# Altium schematic sheet TSAL_DCDC.SchDoc
size A3; SheetNumber: 1; SheetTotal: 1
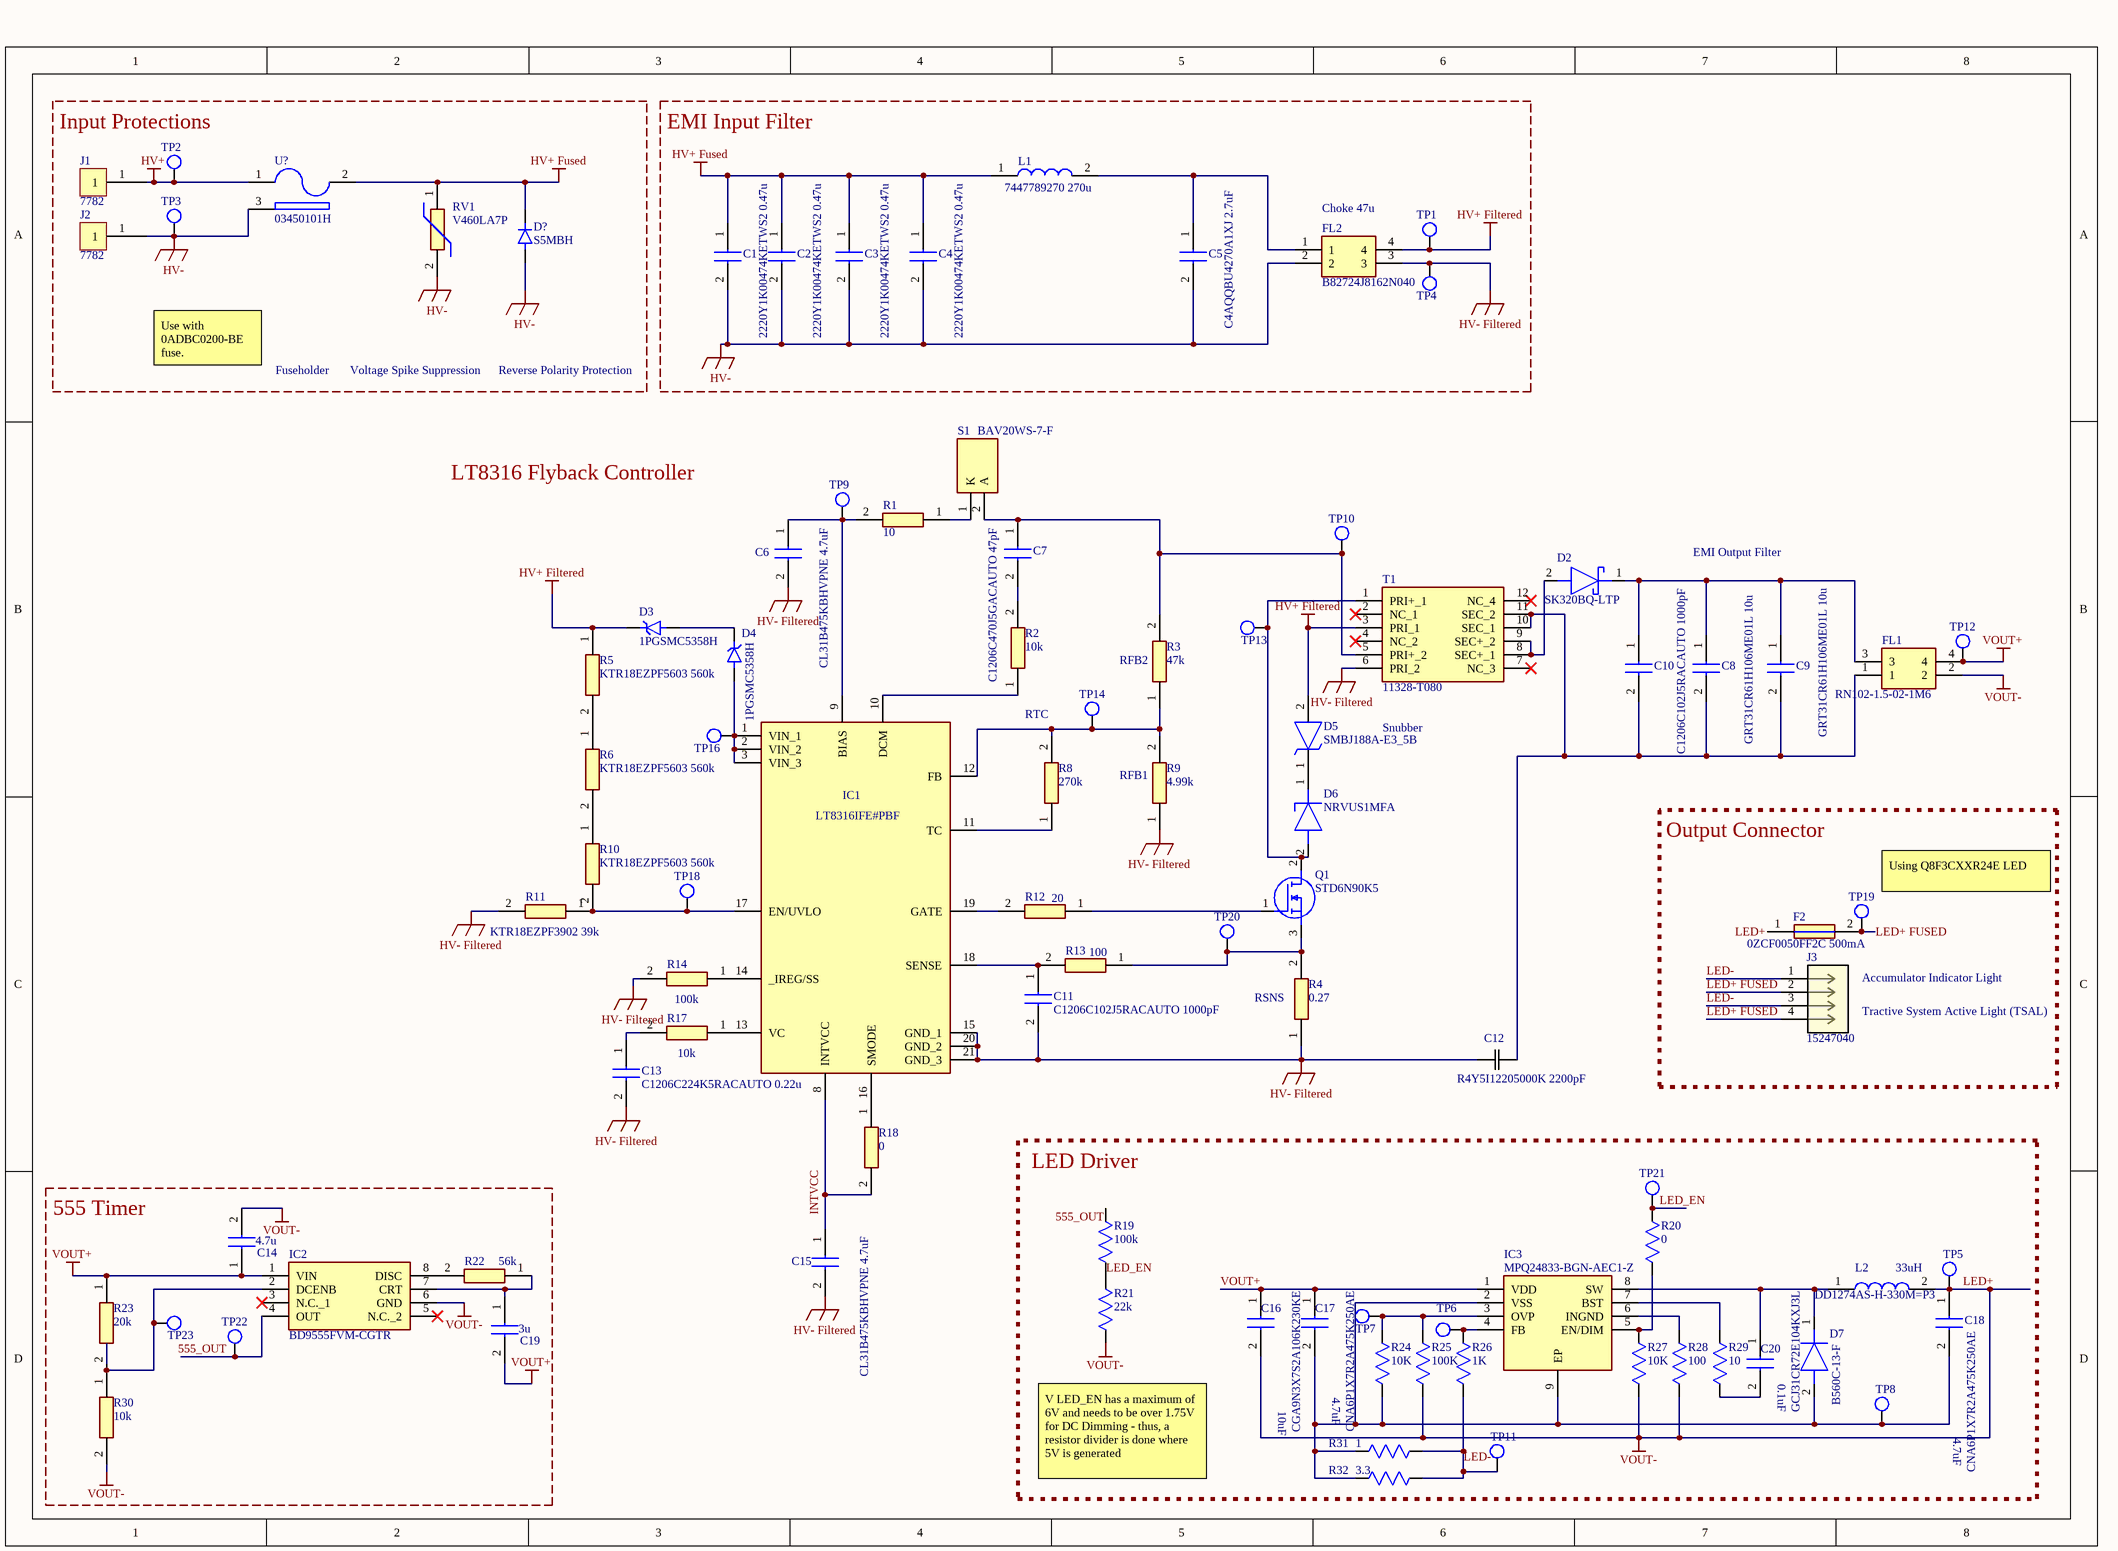
[diagram p0: TSAL_DCDC.SchDoc]

## Parts
C1  2220Y1K00474KETWS2 0.47u  [CAPC5750X200N]
C2  2220Y1K00474KETWS2 0.47u  [CAPC5750X200N]
C3  2220Y1K00474KETWS2 0.47u  [CAPC5750X200N]
C4  2220Y1K00474KETWS2 0.47u  [CAPC5750X200N]
C5  C4AQQBU4270A1XJ 2.7uF  [C4AQSBU4150A1XJ]
C6  CL31B475KBHVPNE 4.7uF  [CAPC3216X180N]
C7  C1206C470J5GACAUTO 47pF  [C1206]
C8  GRT31CR61H106ME01L 10u  [CAPC3216X180N]
C9  GRT31CR61H106ME01L 10u  [CAPC3216X180N]
C10  C1206C102J5RACAUTO 1000pF  [C1206]
C11  C1206C102J5RACAUTO 1000pF  [C1206]
C12  R4Y5I12205000K 2200pF  [CAP_R4Y5I_KEM]
C13  C1206C224K5RACAUTO 0.22u  [C1206]
C14  4.7u  [CAPC3225X279N]
C15  CL31B475KBHVPNE 4.7uF  [CAPC3216X180N]
C16  CGA9N3X7S2A106K230KE  [CAPC5850X280N]
C17  CNA6P1X7R2A475K250AE  [CAPC3225X279N]
C18  CNA6P1X7R2A475K250AE  [CAPC3225X279N]
C19  3u  [CAPC3225X279N]
C20  GCJ31CR72E104KXJ3L  [CAPC3216X200N]
D2  SK320BQ-LTP  [DIOM5336X262N]
D3  1PGSMC5358H  [DIOM6859X262N]
D4  1PGSMC5358H  [DIOM6859X262N]
D5  SMBJ188A-E3_5B  [DIOM5436X244N]
D6  NRVUS1MFA  [SODFL3618X143N]
D7  B560C-13-F  [DIOM7959X250N]
D?  S5MBH  [DIOM4336X265N]
F2  0ZCF0050FF2C 500mA  [FUSC7451X115N]
FL1  RN102-1.5-02-1M6  [RN10215021M6]
FL2  B82724J8162N040  [B82724J8162N040]
IC1  LT8316IFE#PBF  [LT8316IFEPBF]
IC2  BD9555FVM-CGTR  [SOP65P400X90-8N]
IC3  MPQ24833-BGN-AEC1-Z  [SOIC127P600X170-9N]
J1  7782  [7782-Footprint-1]
J2  7782  [7782-Footprint-1]
J3  15247040  [CONN_SDA-42385_04_MOL]
L1  7447789270 270u  [WE-PD_7332/7345_PLASTIC_BASE54]
L2  DD1274AS-H-330M=P3  [1274ASH100MP3]
Q1  STD6N90K5  [STD36P4LLF6]
R1  10  [RESC3216X65N]
R2  10k  [RESC3216X65N]
R3  47k  [RESC3216X65N]
R4  0.27  [RESC3216X65N]
R5  KTR18EZPF5603 560k  [RESC3216X65N]
R6  KTR18EZPF5603 560k  [RESC3216X65N]
R8  270k  [RESC3216X65N]
R9  4.99k  [RESC3216X65N]
R10  KTR18EZPF5603 560k  [RESC3216X65N]
R11  KTR18EZPF3902 39k  [RESC3216X65N]
R12  20  [RESC3216X65N]
R13  100  [RESC3216X65N]
R14  100k  [RESC3216X65N]
R17  10k  [RESC3216X65N]
R18  0  [RESC3216X65N]
R19  100k  [RESC3216X75N]
R20  0  [RESC3216X75N]
R21  22k  [RESC3216X75N]
R22  56k  [RESC3216X65N]
R23  20k  [RESC3216X65N]
R24  10K  [RESC3216X75N]
R25  100K  [RESC3216X75N]
R26  1K  [RESC3216X75N]
R27  10K  [RESC3216X75N]
R28  100  [RESC3216X75N]
R29  10  [RESC3216X75N]
R30  10k  [RESC3216X65N]
R31  1  [RESC3216X75N]
R32  3.3  [RESC3216X75N]
RV1  V460LA7P  [V460LA7P]
S1  BAV20WS-7-F  [SOD2513X120N]
T1  11328-T080  [11328T080]
TP1  5010  [5010]  (value not drawn)
TP2  5010  [5010]  (value not drawn)
TP3  5010  [5010]  (value not drawn)
TP4  5010  [5010]  (value not drawn)
TP5  5010  [5010]  (value not drawn)
TP6  5010  [5010]  (value not drawn)
TP7  5010  [5010]  (value not drawn)
TP8  5010  [5010]  (value not drawn)
TP9  5010  [5010]  (value not drawn)
TP10  5010  [5010]  (value not drawn)
TP11  5010  [5010]  (value not drawn)
TP12  5010  [5010]  (value not drawn)
TP13  5010  [5010]  (value not drawn)
TP14  5010  [5010]  (value not drawn)
TP16  5010  [5010]  (value not drawn)
TP18  5010  [5010]  (value not drawn)
TP19  5010  [5010]  (value not drawn)
TP20  5010  [5010]  (value not drawn)
TP21  5010  [5010]  (value not drawn)
TP22  5010  [5010]  (value not drawn)
TP23  5010  [5010]  (value not drawn)
U?  03450101H  [03450101H]

## Blocks framed on the sheet
Input Protections: D? J1 J2 RV1 TP2 TP3 U?
EMI Input Filter: C1-C5 FL2 L1 TP1 TP4
Output Connector: F2 J3 TP19
LED Driver: C16-C18 C20 D7 IC3 L2 R19-R21 R24-R29 R31 R32 TP5-TP8 TP11 TP21
555 Timer: C14 C19 IC2 R22 R23 R30 TP22 TP23

## Nets
HV+: J1.1 TP2.1 U?.1
HV+ Filtered: D3.C(K) D5.2(A) FL2.4 R5.1 T1.3(PRI_1) TP1.1
HV+ Fused: C1.1 C2.1 C3.1 C4.1 D?.C(K) L1.1 RV1.1 U?.2
HV-: C1.2 C2.2 C3.2 C4.2 C5.2 D?.A FL2.2 J2.1 RV1.2 TP3.1 U?.3
HV- Filtered: C6.2 C11.2 C12.1 C13.2 C15.2 FL2.3 IC1.15(GND_1) IC1.20(GND_2) IC1.21(GND_3) R4.1 R9.1 R11.2 R14.2 T1.6(PRI_2) TP4.1
LED+: C14.2 C16.2 C18.1 F2.1 FL1.2 IC2.6(GND) L2.2 R21.1 R25.2 R27.2 R28.2 R30.2 TP5.1  [also labelled VOUT-]
VOUT+: C14.1 C16.1 C17.1 C19.2 FL1.4 IC2.1(VIN) IC3.1(VDD) R23.1 TP12.1
555_OUT: IC2.4(OUT) R19.2 TP22.1
LED+ FUSED: F2.2 J3.2 J3.4 TP19.1
LED-: J3.1 J3.3 R26.2 R31.2 R32.2 TP11.1
LED_EN: R19.1 R20.2 R21.2 TP21.1
NetC5_1: C5.1 FL2.1 L1.2
NetC6_1: C6.1 IC1.9(BIAS) R1.2 TP9.1
NetC7_1: C7.1 R3.2 S1.2(A) T1.5(PRI+_2) TP10.1
NetC7_2: C7.2 R2.2
NetC8_1: C8.1 C9.1 C10.1 D2.1(K) FL1.3
NetC8_2: C8.2 C9.2 C10.2 C12.2 FL1.1 T1.10(SEC_1) T1.11(SEC_2)
NetC11_1: C11.1 IC1.18(SENSE) R13.2
NetC13_1: C13.1 R17.2
NetC15_1: C15.1 IC1.8(INTVCC) R18.2
NetC17_2: C17.2 C18.2 D7.2(A) IC3.2(VSS) IC3.9(EP) R24.2 R31.1 R32.1 TP8.1
NetC19_1: C19.1 IC2.7(CRT) R22.1
NetC20_1: C20.1 D7.1(K) IC3.8(SW) L2.1
NetC20_2: C20.2 R29.1
NetD2_2: D2.2(A) T1.8(SEC+_1) T1.9(SEC+_2)
NetD3_A: D3.A D4.C(K)
NetD4_A: D4.A IC1.1(VIN_1) IC1.2(VIN_2) IC1.3(VIN_3) TP16.1
NetD5_1: D5.1(K) D6.1(K)
NetD6_2: D6.2(A) Q1.2(D) T1.1(PRI+_1) TP13.1
NetIC1_10: IC1.10(DCM) R2.1
NetIC1_11: IC1.11(TC) R8.1
NetIC1_12: IC1.12(FB) R3.1 R8.2 R9.2 TP14.1
NetIC1_13: IC1.13(VC) R17.1
NetIC1_14: IC1.14(_IREG/SS) R14.1
NetIC1_16: IC1.16(SMODE) R18.1
NetIC1_17: IC1.17(EN/UVLO) R10.2 R11.1 TP18.1
NetIC1_19: IC1.19(GATE) R12.2
NetIC2_2: IC2.2(DCENB) R23.2 R30.1 TP23.1
NetIC2_8: IC2.8(DISC) R22.2
NetIC3_3: IC3.3(OVP) R24.1 R25.1 TP7.1
NetIC3_4: IC3.4(FB) R26.1 TP6.1
NetIC3_5: IC3.5(EN/DIM) R20.1 R27.1
NetIC3_6: IC3.6(INGND) R28.1
NetIC3_7: IC3.7(BST) R29.2
NetQ1_1: Q1.1(G) R12.1
NetQ1_3: Q1.3(S) R4.2 R13.1 TP20.1
NetR1_1: R1.1 S1.1(K)
NetR5_2: R5.2 R6.1
NetR6_2: R6.2 R10.1

Not connected (* = marked no-connect by the designer): IC2 3(N.C._1)* 5(N.C._2)*; T1 2(NC_1)* 4(NC_2)* 7(NC_3)* 12(NC_4)*

## Notes on the sheet
- (near FL2) Choke 47u
- Use with 0ADBC0200-BE fuse.
- Fuseholder
- Voltage Spike Suppression
- Reverse Polarity Protection
- LT8316 Flyback Controller
- EMI Output Filter
- (near R3) RFB2
- RTC
- Snubber
- (near R9) RFB1
- (near TP19) Using Q8F3CXXR24E LED
- (near R4) RSNS
- Accumulator Indicator Light
- Tractive System Active Light (TSAL)
- (near L2) 33uH
- 10uF
- 4.7uF
- 0.1uF
- V LED_EN has a maximum of 6V and needs to be over 1.75V for DC Dimming - thus, a resistor divider is done where 5V is generated
- Labels drawn without touching a wire or pin: INTVCC

## Library data of the parts
C1-C4 = 2220Y1K00474KETWS2: Capacitor; Manufacturer_Name: Knowles; Datasheet Link: https://componentsearchengine.com/Datasheets/1/2220Y1K00474KETWS2.pdf; Height: 2mm; Manufacturer_Part_Number: 2220Y1K00474KETWS2
C5 = C4AQSBU4150A1XJ: Capacitor C4AQQBU4270A1XJ actually; Manufacturer_Name: KEMET; Datasheet Link: https://content.kemet.com/datasheets/KEM_F3114_C4AQ.pdf; Height: 25.2mm; Manufacturer_Part_Number: C4AQQBU4270A1XJ
C6 C15 = CL31B475KBHVPNE: Capacitor; Manufacturer_Name: SAMSUNG; Datasheet Link: https://static6.arrow.com/aropdfconversion/b7e74fd130fed86f0f6f64070a746c2dc32c0626/cl31b475kbhvpn_specsheet.pdf; Height: 1.8mm; Manufacturer_Part_Number: CL31B475KBHVPNE; Mouser Part Number: N/A; Mouser Price/Stock: https://www.mouser.co.uk/ProductDetail/Samsung-Electro-Mechanics/CL31B475KBHVPNE?qs=WO7YBshssFEldhRLajlFiw%3D%3D
C7 = C1206C470J5GACAUTO: Capacitor; Manufacturer_Name: KEMET; Datasheet Link: https://content.kemet.com/datasheets/KEM_C1022_C0G_AUTO_SMD.pdf; Manufacturer_Part_Number: C1206C470J5GACAUTO; Mouser Part Number: 80-C1206C470J5GAUTO; Mouser Price/Stock: https://www.mouser.co.uk/ProductDetail/KEMET/C1206C470J5GACAUTO?qs=2FIyTMJ0hNmtBF6JAw%252BWLg%3D%3D
C8 C9 = GRT31CR61H106ME01L: Capacitor; Manufacturer_Name: Murata Electronics; Datasheet Link: https://search.murata.co.jp/Ceramy/image/img/A01X/G101/ENG/GRT31CR61H106ME01-01.pdf; Height: 1.8mm; Manufacturer_Part_Number: GRT31CR61H106ME01L; Mouser Part Number: 81-GRT31CR61H106ME1L; Mouser Price/Stock: https://www.mouser.co.uk/ProductDetail/Murata-Electronics/GRT31CR61H106ME01L?qs=drgMNd%252BkGPP7mqBBLgvqfw%3D%3D; Arrow Part Number: GRT31CR61H106ME01L; Arrow Price/Stock: https://www.arrow.com/en/products/grt31cr61h106me01l/murata-manufacturing?region=nac
C10 C11 = C1206C102J5RACAUTO: Capacitor; Manufacturer_Name: KEMET; Datasheet Link: https://content.kemet.com/datasheets/KEM_C1023_X7R_AUTO_SMD.pdf; Manufacturer_Part_Number: C1206C102J5RACAUTO
C12 = CMP-001-00408-1: No Description Available; Mfr_Name: Kemet; Type: Film Capacitors; Design Item ID: R4Y5I12205000K; Source: R4Y5I12205000K.SchLib
C13 = C1206C224K5RACAUTO: Capacitor; Manufacturer_Name: KEMET; Datasheet Link: https://content.kemet.com/datasheets/KEM_C1023_X7R_AUTO_SMD.pdf; Manufacturer_Part_Number: C1206C224K5RACAUTO; Mouser Part Number: 80-C1206C224K5RAUTO; Mouser Price/Stock: https://www.mouser.com/Search/Refine.aspx?Keyword=80-C1206C224K5RAUTO; Arrow Part Number: C1206C224K5RACAUTO; Arrow Price/Stock: https://www.arrow.com/en/products/c1206c224k5racauto/kemet-corporation?region=nac
C14 C17-C19 = CMP-004-000011-1: Multilayer Ceramic Capacitors MLCC - SMD/SMT 100V 4.7uF X7R 1210 10% Flex AEC-Q200; Manufacturer_Name: Kyocera AVX; Manufacturer_Part_Number: 12101C475K4Z2A; Source: SamacSys.SchLib; Arrow Part Number: 12101C475K4Z2A; Mouser Price/Stock: https://www.mouser.co.uk/ProductDetail/Kyocera-AVX/12101C475K4Z2A?qs=EU6FO9ffTwdiHnQTh%2FMZ2w%3D%3D; Height: 2.79mm; Design Item ID: 12101C475K4Z2A; Arrow Price/Stock: https://www.arrow.com/en/products/12101c475k4z2a/avx; Datasheet Link: https://www.mouser.de/ProductDetail/Kyocera-AVX/12101C475K4Z2A?qs=EU6FO9ffTwdiHnQTh%2FMZ2w%3D%3D; Mouser Part Number: 581-12101C475K4Z2A
C16 = CMP-004-000021-1: Multilayer Ceramic Capacitors MLCC - SMD/SMT SOFT 2220 100V 10uF X7S 10% AEC-Q200; Manufacturer_Name: TDK; Datasheet Link: https://product.tdk.com/system/files/dam/doc/product/capacitor/ceramic/mlcc/catalog/mlcc_automotive_soft_en.pdf; Height: 2.8mm; Manufacturer_Part_Number: CGA9N3X7S2A106K230KE; Mouser Part Number: 810-CGA9N3X7S2A106KS; Mouser Price/Stock: https://www.mouser.co.uk/ProductDetail/TDK/CGA9N3X7S2A106K230KE?qs=FxQuwy19cyC8TXs2ZwvXNA%3D%3D; Design Item ID: CGA9N3X7S2A106K230KE; Source: SamacSys.SchLib
C20 = CMP-004-000019-1: Multilayer Ceramic Capacitors MLCC - SMD/SMT 1206 0.1uF 250volts X7R 10% Soft Term; Manufacturer_Name: Murata Electronics; Datasheet Link: https://psearch.en.murata.com/capacitor/product/GCJ31CR72E104KXJ3%23.html; Height: 2mm; Manufacturer_Part_Number: GCJ31CR72E104KXJ3L; Mouser Part Number: 81-GCJ31CR72E104KX3L; Mouser Price/Stock: https://www.mouser.co.uk/ProductDetail/Murata-Electronics/GCJ31CR72E104KXJ3L?qs=z91OOxY4Wyd%252BRnESA%252BCgAQ%3D%3D; Arrow Part Number: GCJ31CR72E104KXJ3L; Arrow Price/Stock: https://www.arrow.com/en/products/gcj31cr72e104kxj3l/murata-manufacturing?region=nac; Design Item ID: GCJ31CR72E104KXJ3L; Source: SamacSys.SchLib
D2 = SK320BQ-LTP: Schottky Diode; Manufacturer_Name: MCC; Datasheet Link: https://mccsemi.com/pdf/Products/SK310BQ-L_SK320BQ-L(SMB).pdf; Height: 2.62mm; Manufacturer_Part_Number: SK320BQ-LTP
D3 D4 = CMP-004-00092-1: Availability: Unavailable; MP: 1PGSMC5358H; Price: None; Component Type: Standard; Pins: 2; Design Item ID: 1PGSMC5358H; Case/Package: None; Value: *; Source: 1PGSMC5358H.SchLib
D5 = SMBJ188A-E3_5B: TVS Diode (Uni-directional); Manufacturer_Name: Vishay; Manufacturer_Part_Number: SMBJ188A-E3/5B; Datasheet Link: http://www.vishay.com/docs/88392/smbj.pdf; Height: 2.44mm
D6 = NRVUS1MFA: Diode ESD (Uni-directional); Manufacturer_Name: onsemi; Datasheet Link: https://www.mouser.ca/datasheet/2/308/1/US1MFA_D-2320257.pdf; Height: 1.43mm; Manufacturer_Part_Number: NRVUS1MFA
D7 = CMP-017-000000-1: Schottky Diodes & Rectifiers 60V 5A; Manufacturer_Name: Diodes Incorporated; Datasheet Link: https://datasheet.lcsc.com/szlcsc/Diodes-Incorporated-B560C-13-F_C85100.pdf; Height: 2.5mm; Manufacturer_Part_Number: B560C-13-F; Mouser Part Number: 621-B560C-F; Mouser Price/Stock: https://www.mouser.co.uk/ProductDetail/Diodes-Incorporated/B560C-13-F?qs=OC0R%252Bhozcm%252BAsjMXklZLIw%3D%3D; Arrow Part Number: B560C-13-F; Arrow Price/Stock: https://www.arrow.com/en/products/b560c-13-f/diodes-incorporated?region=nac; Design Item ID: B560C-13-F; Source: SamacSys.SchLib
D? = CMP-004-00093-2: DIODE GEN PURP 5A DO214AA; Value: *; Component Type: Standard; MP: S5MBH; Availability: Unavailable; Design Item ID: S5MBH; Pins: 2; Source: S5MBH.SchLib; Case/Package: None; Price: None
F2 = 0ZCF0050FF2C: Fuse; Manufacturer_Name: BelFuse; Datasheet Link: https://componentsearchengine.com/Datasheets/2/0ZCF0050FF2C.pdf; Height: 1.15mm; Manufacturer_Part_Number: 0ZCF0050FF2C; Mouser Part Number: 530-0ZCF0050FF2C; Mouser Price/Stock: https://www.mouser.co.uk/ProductDetail/Bel-Fuse/0ZCF0050FF2C?qs=SRYZG9HaIQ2nQLM5Xvfc5w%3D%3D; Arrow Part Number: 0ZCF0050FF2C; Arrow Price/Stock: https://www.arrow.com/en/products/0zcf0050ff2c/bel-group?region=europe
FL1 = RN102-1.5-02-1M6: Filter; Manufacturer_Name: Schaffner; Datasheet Link: https://www.arrow.com/en/products/rn102-1.5-02-1m6/schaffner; Height: 9.3mm; Manufacturer_Part_Number: RN102-1.5-02-1M6; Mouser Part Number: 631-RN102-1.5-02-1M6; Mouser Price/Stock: https://www.mouser.co.uk/ProductDetail/Schaffner/RN102-1.5-02-1M6?qs=WyAARYrbSnZUk2zsVcIpdw%3D%3D; Arrow Part Number: RN102-1.5-02-1M6; Arrow Price/Stock: https://www.arrow.com/en/products/rn102-1.5-02-1m6/schaffner?region=nac
FL2 = B82724J8162N040: Filter; Manufacturer_Name: TDK; Datasheet Link: https://product.tdk.com/system/files/dam/doc/product/emc/emc/line-filter/data_sheet/30/ds/b82724j8xn.pdf; Height: 33.2mm; Manufacturer_Part_Number: B82724J8162N040; Mouser Part Number: 871-B82724J8162N040; Mouser Price/Stock: https://www.mouser.co.uk/ProductDetail/EPCOS-TDK/B82724J8162N040?qs=%252BEew9%252B0nqrCJ%252BtEJRIYp4Q%3D%3D; Arrow Part Number: B82724J8162N040; Arrow Price/Stock: https://www.arrow.com/en/products/b82724j8162n040/epcos-tdk
IC1 = LT8316IFE#PBF: Integrated Circuit; Manufacturer_Name: Analog Devices; Datasheet Link: https://www.mouser.de/datasheet/2/609/LT8316-1545981.pdf; Height: 1.2mm; Manufacturer_Part_Number: LT8316IFE#PBF; Mouser Part Number: 584-LT8316IFE#PBF; Mouser Price/Stock: https://www.mouser.co.uk/ProductDetail/Analog-Devices/LT8316IFEPBF?qs=0lSvoLzn4L8i5eDlmF3zZw%3D%3D; Arrow Part Number: LT8316IFE#PBF; Arrow Price/Stock: https://www.arrow.com/en/products/lt8316ifepbf/analog-devices?region=nac
IC2 = BD9555FVM-CGTR: Integrated Circuit; Manufacturer_Name: ROHM Semiconductor; Datasheet Link: https://componentsearchengine.com/Datasheets/1/BD9555FVM-CGTR.pdf; Height: 0.9mm; Manufacturer_Part_Number: BD9555FVM-CGTR; Mouser Part Number: 755-BD9555FVM-CGTR; Mouser Price/Stock: https://www.mouser.co.uk/ProductDetail/ROHM-Semiconductor/BD9555FVM-CGTR?qs=zGux8KhMp6L6leLJfwr4Uw%3D%3D
IC3 = CMP-006-000033-1: MONOLITHIC POWER SYSTEMS (MPS) - MPQ24833-BGN-AEC1-Z - LED Driver; Mouser Price/Stock: https://www.mouser.co.uk/ProductDetail/Monolithic-Power-Systems-MPS/MPQ24833-BGN-AEC1-Z?qs=GedFDFLaBXG49qp8%2FyrO0w%3D%3D; Manufacturer_Name: Monolithic Power Systems (MPS); Height: 1.7mm; Source: SamacSys.SchLib; Design Item ID: MPQ24833-BGN-AEC1-Z; Mouser Part Number: 946-MPQ24833BGNAEC1Z; Datasheet Link: https://www.mouser.in/datasheet/2/277/MPQ24833_BGN_AEC1-2946532.pdf; Manufacturer_Part_Number: MPQ24833-BGN-AEC1-Z
J1 J2 = CMP-002-00097-2: Screw terminal
J3 = CMP-056-000000-2: 0015247040 molex 4 pin connector; Mfr_Name: Molex Connector Corporation; Source: 15247040.SchLib; Design Item ID: 15247040; Type: Type; RefDes: RefDes
L1 = 7447789270: Inductor; Manufacturer_Name: Wurth Elektronik; Manufacturer_Part_Number: 7447789270; Mouser Part Number: 710-7447789270; Mouser Price/Stock: https://www.mouser.co.uk/ProductDetail/Wurth-Elektronik/7447789270?qs=XJfXErqHgA5azZScX3JK7w%3D%3D
L2 = CMP-005-000014-1: DEM10050C_DD Series Inductor 33uH +/-20% 3939 (100100); Manufacturer_Name: Murata Electronics; Manufacturer_Part_Number: DD1274AS-H-330M=P3; Arrow Part Number: DD1274AS-H-330M=P3; Design Item ID: DD1274AS-H-330M=P3; Mouser Price/Stock: https://www.mouser.co.uk/ProductDetail/Murata-Electronics/DD1274AS-H-330M%3dP3?qs=ty6qhqyUUEupALyz55KYRQ%3D%3D; Height: 5.3mm; Datasheet Link: https://psearch.en.murata.com/inductor/product/DD1274AS-H-330M%23.html; Source: SamacSys.SchLib; Mouser Part Number: 81-DD1274AS-H-330MP3; Arrow Price/Stock: https://www.arrow.com/en/products/dd1274as-h-330mp3/murata-manufacturing
Q1 = STD6N90K5: MOSFET (N-Channel); Manufacturer_Name: STMicroelectronics; Datasheet Link: https://www.st.com/resource/en/datasheet/std6n90k5.pdf; Height: 2mm; Manufacturer_Part_Number: STD6N90K5; Arrow Part Number: STD6N90K5; Arrow Price/Stock: https://www.arrow.com/en/products/std6n90k5/stmicroelectronics?utm_currency=USD&region=nac
R1 R2 R5 R6 R10 R22 R23 R30 = KTR18EZPF5603: Resistor; Manufacturer_Name: ROHM Semiconductor; Datasheet Link: http://rohmfs.rohm.com/en/products/databook/datasheet/passive/resistor/chip_resistor/ktr.pdf; Height: 0.65mm; Manufacturer_Part_Number: KTR18EZPF5603; Mouser Part Number: 755-KTR18EZPF5603; Mouser Price/Stock: https://www.mouser.com/Search/Refine.aspx?Keyword=755-KTR18EZPF5603
R3 R4 R8 R9 R11-R14 R17 R18 = KTR18EZPF3902: Resistor; Manufacturer_Name: ROHM Semiconductor; Datasheet Link: http://rohmfs.rohm.com/en/products/databook/datasheet/passive/resistor/chip_resistor/ktr.pdf; Height: 0.65mm; Manufacturer_Part_Number: KTR18EZPF3902
R19-R21 R24-R29 R31 R32 = CMP-009-00233-1: Resistor; Manufacturer_Name: Bourns; Manufacturer_Part_Number: CR1206-F/-2R00ELF; Height: 0.75mm; Mouser Part Number: 652-CR1206-F/2R00ELF; Mouser Price/Stock: https://www.mouser.co.uk/ProductDetail/Bourns/CR1206-F-2R00ELF?qs=W%2FMpXkg%252BdQ47Z%2FeZv1nDSg%3D%3D; Design Item ID: CR1206-F_-2R00ELF; Source: SamacSys.SchLib
RV1 = V460LA7P: Varistor; Manufacturer_Name: LITTELFUSE; Datasheet Link: https://m.littelfuse.com/media?resourcetype=datasheets&itemid=f7c547ce-c2fa-4789-86cc-ec39a5060afb&filename=littelfuse-varistor-la-datasheet; Height: 13mm; Manufacturer_Part_Number: V460LA7P
S1 = BAV20WS-7-F: Switch; Manufacturer_Name: Diodes Incorporated; Datasheet Link: https://www.diodes.com//assets/Datasheets/BAV19WS-BAV21WS.pdf; Height: 1.2mm; Manufacturer_Part_Number: BAV20WS-7-F; Arrow Part Number: BAV20WS-7-F; Arrow Price/Stock: https://www.arrow.com/en/products/bav20ws-7-f/diodes-incorporated?region=nac
T1 = 11328-T080: Transformer; Manufacturer_Name: Sumida; Datasheet Link: https://products.sumida.com/products/pdf/LT8316-PQ2620-Datasheet-ver.3_20190825.pdf?t=1682846469; Manufacturer_Part_Number: 11328-T080; Mouser Part Number: 851-11328-T080; Mouser Price/Stock: https://www.mouser.co.uk/ProductDetail/Sumida/11328-T080?qs=DRkmTr78QASTuR6uSjxAcA%3D%3D
TP1-TP14 TP16 TP18-TP23 = CMP-034-000000-2: Test Point; Manufacturer_Name: Keystone Electronics; Arrow Part Number: 5010; Source: SamacSys.SchLib; Arrow Price/Stock: https://www.arrow.com/en/products/5010/keystone-electronics?region=europe; Mouser Price/Stock: https://www.mouser.co.uk/ProductDetail/Keystone-Electronics/5010?qs=qOqV1E1P08SzD%252BWfk1wMXQ%3D%3D; Height: 8.28mm; Design Item ID: 5010; Mouser Part Number: 534-5010; Manufacturer_Part_Number: 5010; Datasheet Link: http://www.farnell.com/datasheets/1703983.pdf
U? = CMP-007-000290-1: Undefined or Miscellaneous; Manufacturer_Name: LITTELFUSE; Arrow Part Number: 03450101H; Manufacturer_Part_Number: 03450101H; Mouser Price/Stock: https://www.mouser.co.uk/ProductDetail/Littelfuse/03450101H?qs=gu7KAQ731UREbYiF7UHFpA%3D%3D; Height: 12.192mm; Datasheet Link: https://componentsearchengine.com/Datasheets/1/03450101H.pdf; Source: SamacSys.SchLib; Arrow Price/Stock: https://www.arrow.com/en/products/03450101h/littelfuse?region=nac; Design Item ID: 03450101H; Mouser Part Number: 576-03450101H